# EAGLE schematic backpack_v1 (EAGLE 6.5.0)
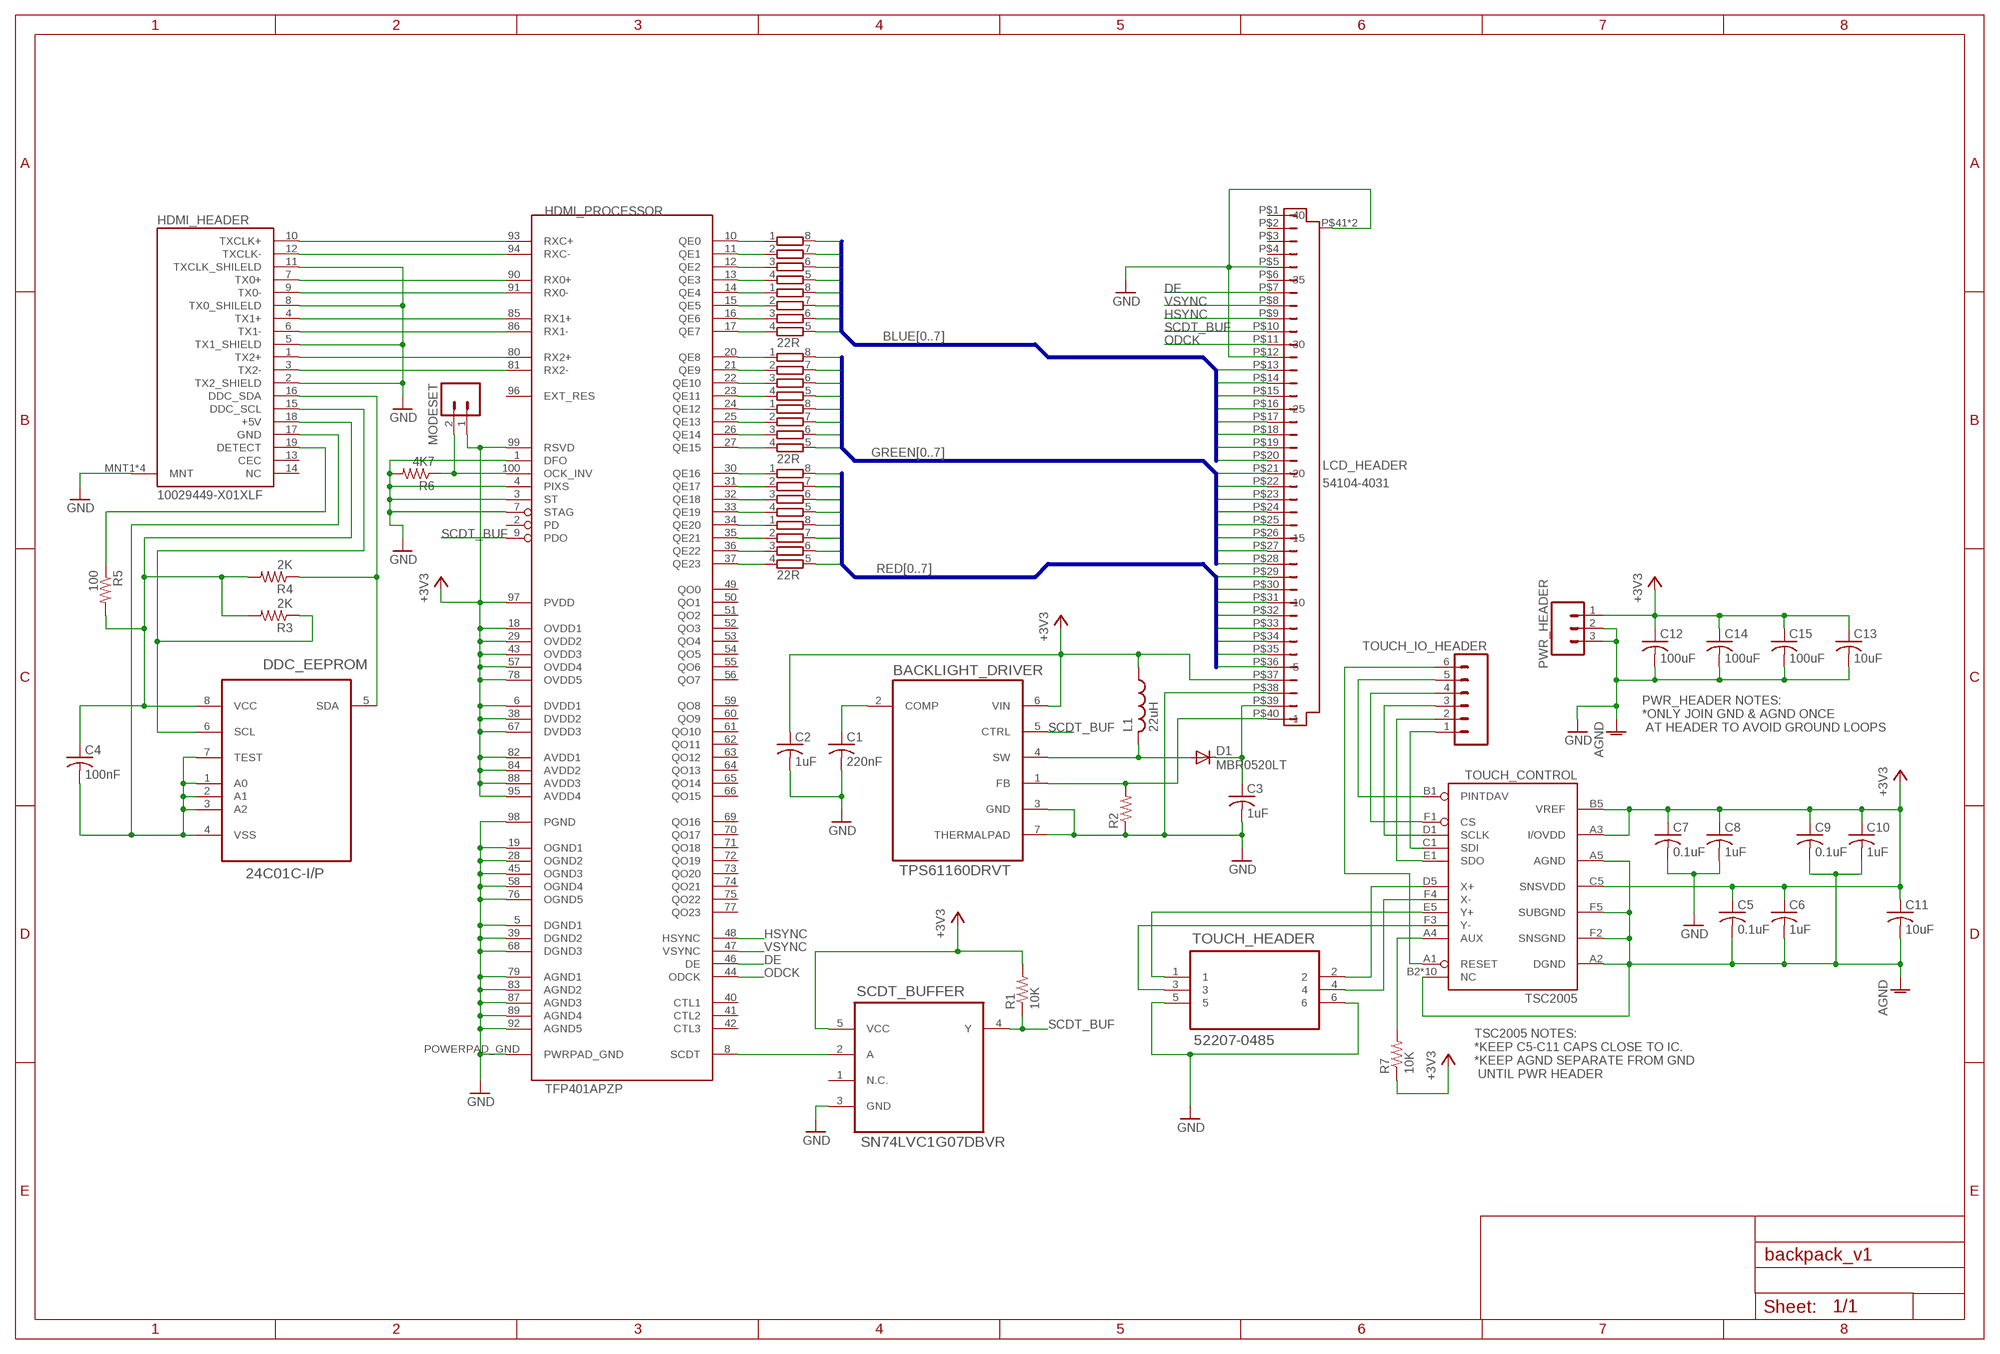
[diagram p0: schematic, sheet 1]

## Parts
BACKLIGHT_DRIVER  TPS61160DRVT  [SON65P210X210X80-7N]
C1  220nF  C-USC0805  [C0805]
C2  1uF  C-USC0805  [C0805]
C3  1uF  C-USC0805  [C0805]
C4  100nF  C-USC0805  [C0805]
C5  0.1uF  C-USC0805  [C0805]
C6  1uF  C-USC0805  [C0805]
C7  0.1uF  C-USC0805  [C0805]
C8  1uF  C-USC0805  [C0805]
C9  0.1uF  C-USC0805  [C0805]
C10  1uF  C-USC0805  [C0805]
C11  10uF  C-USC0805  [C0805]
C12  100uF  C-USC1206  [C1206]
C13  10uF  C-USC1206  [C1206]
C14  100uF  C-USC1206  [C1206]
C15  100uF  C-USC1206  [C1206]
D1  MBR0520LT  [SOD123]
DDC_EEPROM  24C01C-I/P  [DIP254P762X533-8]
HDMI_HEADER  10029449-X01XLF  [10029449]
HDMI_PROCESSOR  TFP401APZP  [100-TQFP(PZP)]
L1  22uH  L-USL4532P  [L4532P]
LCD_HEADER  54104-4031  [54104-4031]
MODESET  M02PTH  [1X02]
PWR_HEADER  M03POLAR  [MOLEX-1X3]
R1  10K  R-US_M1206  [M1206]
R2  R-US_M1206  [M1206]
R3  2K  R-US_M1206  [M1206]
R4  2K  R-US_M1206  [M1206]
R5  100  R-US_M1206  [M1206]
R6  4K7  R-US_M1206  [M1206]
R7  10K  R-US_M1206  [M1206]
RN1  22R  4R-NCAY16  [CAY16]
RN2  22R  4R-NCAY16  [CAY16]
RN3  22R  4R-NCAY16  [CAY16]
RN4  22R  4R-NCAY16  [CAY16]
RN5  22R  4R-NCAY16  [CAY16]
RN6  22R  4R-NCAY16  [CAY16]
SCDT_BUFFER  SN74LVC1G07DBVR  [SOT95P280X145-5N]
TOUCH_CONTROL  TSC2005  [YZL]
TOUCH_HEADER  52207-0485  [MOLEX_52207-0485]
TOUCH_IO_HEADER  M06RA  [MOLEX-1X6-RA]

## Nets
+3V3: BACKLIGHT_DRIVER.6(VIN) C2.1 C5.1 C6.1 C7.1 C8.1 C9.1 C10.1 C11.1 C12.1 C13.1 C14.1 C15.1 L1.1 LCD_HEADER.P$37 PWR_HEADER.1 R1.2 R7.1 SCDT_BUFFER.5(VCC) TOUCH_CONTROL.A3(I/OVDD) TOUCH_CONTROL.B5(VREF) TOUCH_CONTROL.C5(SNSVDD)
AGND: C5.2 C6.2 C9.2 C10.2 C11.2 TOUCH_CONTROL.A2(DGND) TOUCH_CONTROL.A5(AGND) TOUCH_CONTROL.B2(NC) TOUCH_CONTROL.B3(NC) TOUCH_CONTROL.B4(NC) TOUCH_CONTROL.C2(NC) TOUCH_CONTROL.D2(NC) TOUCH_CONTROL.D3(NC) TOUCH_CONTROL.D4(NC) TOUCH_CONTROL.E2(NC) TOUCH_CONTROL.E3(NC) TOUCH_CONTROL.E4(NC) TOUCH_CONTROL.F2(SNSGND) TOUCH_CONTROL.F5(SUBGND)
BLUE0: LCD_HEADER.P$20 RN1.8
BLUE1: LCD_HEADER.P$19 RN1.7
BLUE2: LCD_HEADER.P$18 RN1.6
BLUE3: LCD_HEADER.P$17 RN1.5
BLUE4: LCD_HEADER.P$16 RN2.8
BLUE5: LCD_HEADER.P$15 RN2.7
BLUE6: LCD_HEADER.P$14 RN2.6
BLUE7: LCD_HEADER.P$13 RN2.5
DE: HDMI_PROCESSOR.46(DE) LCD_HEADER.P$7
GND: BACKLIGHT_DRIVER.3(GND) BACKLIGHT_DRIVER.7(THERMALPAD) C1.2 C2.2 C3.2 C7.2 C8.2 C12.2 C13.2 C14.2 C15.2 HDMI_HEADER.2(TX2_SHIELD) HDMI_HEADER.5(TX1_SHIELD) HDMI_HEADER.8(TX0_SHILELD) HDMI_HEADER.11(TXCLK_SHILELD) HDMI_HEADER.MNT1(MNT) HDMI_HEADER.MNT2(MNT) HDMI_HEADER.MNT3(MNT) HDMI_HEADER.MNT4(MNT) HDMI_PROCESSOR.1(DFO) HDMI_PROCESSOR.3(ST) HDMI_PROCESSOR.4(PIXS) HDMI_PROCESSOR.5(DGND1) HDMI_PROCESSOR.7(STAG) HDMI_PROCESSOR.19(OGND1) HDMI_PROCESSOR.28(OGND2) HDMI_PROCESSOR.39(DGND2) HDMI_PROCESSOR.45(OGND3) HDMI_PROCESSOR.58(OGND4) HDMI_PROCESSOR.68(DGND3) HDMI_PROCESSOR.76(OGND5) HDMI_PROCESSOR.79(AGND1) HDMI_PROCESSOR.83(AGND2) HDMI_PROCESSOR.87(AGND3) HDMI_PROCESSOR.89(AGND4) HDMI_PROCESSOR.92(AGND5) HDMI_PROCESSOR.98(PGND) HDMI_PROCESSOR.POWERPAD_GND(PWRPAD_GND) LCD_HEADER.P$5 LCD_HEADER.P$12 LCD_HEADER.P$38 LCD_HEADER.P$41(GND) LCD_HEADER.P$42(GND) PWR_HEADER.2 PWR_HEADER.3 R2.1 R6.2 SCDT_BUFFER.3(GND) TOUCH_HEADER.5 TOUCH_HEADER.6 ; supply symbol labelled AGND
GREEN0: LCD_HEADER.P$28 RN3.8
GREEN1: LCD_HEADER.P$27 RN3.7
GREEN2: LCD_HEADER.P$26 RN3.6
GREEN3: LCD_HEADER.P$25 RN3.5
GREEN4: LCD_HEADER.P$24 RN4.8
GREEN5: LCD_HEADER.P$23 RN4.7
GREEN6: LCD_HEADER.P$22 RN4.6
GREEN7: LCD_HEADER.P$21 RN4.5
HSYNC: HDMI_PROCESSOR.48(HSYNC) LCD_HEADER.P$9
N$1: HDMI_PROCESSOR.10(QE0) RN1.1
N$2: HDMI_PROCESSOR.11(QE1) RN1.2
N$3: HDMI_PROCESSOR.12(QE2) RN1.3
N$4: HDMI_PROCESSOR.13(QE3) RN1.4
N$5: HDMI_PROCESSOR.14(QE4) RN2.1
N$6: HDMI_PROCESSOR.15(QE5) RN2.2
N$7: HDMI_PROCESSOR.16(QE6) RN2.3
N$8: HDMI_PROCESSOR.17(QE7) RN2.4
N$9: HDMI_PROCESSOR.20(QE8) RN3.1
N$10: HDMI_PROCESSOR.21(QE9) RN3.2
N$11: HDMI_PROCESSOR.22(QE10) RN3.3
N$12: HDMI_PROCESSOR.23(QE11) RN3.4
N$13: HDMI_PROCESSOR.24(QE12) RN4.1
N$14: HDMI_PROCESSOR.25(QE13) RN4.2
N$15: HDMI_PROCESSOR.26(QE14) RN4.3
N$16: HDMI_PROCESSOR.27(QE15) RN4.4
N$17: HDMI_PROCESSOR.30(QE16) RN5.1
N$18: HDMI_PROCESSOR.31(QE17) RN5.2
N$19: HDMI_PROCESSOR.32(QE18) RN5.3
N$20: HDMI_PROCESSOR.33(QE19) RN5.4
N$21: HDMI_PROCESSOR.34(QE20) RN6.1
N$22: HDMI_PROCESSOR.35(QE21) RN6.2
N$23: HDMI_PROCESSOR.36(QE22) RN6.3
N$24: HDMI_PROCESSOR.37(QE23) RN6.4
N$25: HDMI_PROCESSOR.8(SCDT) SCDT_BUFFER.2(A)
N$26: BACKLIGHT_DRIVER.2(COMP) C1.1
N$27: BACKLIGHT_DRIVER.4(SW) D1.A L1.2
N$28: C3.1 D1.C LCD_HEADER.P$39
N$29: HDMI_HEADER.10(TXCLK+) HDMI_PROCESSOR.93(RXC+)
N$30: BACKLIGHT_DRIVER.1(FB) LCD_HEADER.P$40 R2.2
N$31: HDMI_HEADER.12(TXCLK-) HDMI_PROCESSOR.94(RXC-)
N$32: HDMI_HEADER.7(TX0+) HDMI_PROCESSOR.90(RX0+)
N$33: HDMI_HEADER.9(TX0-) HDMI_PROCESSOR.91(RX0-)
N$34: HDMI_HEADER.4(TX1+) HDMI_PROCESSOR.85(RX1+)
N$35: HDMI_HEADER.6(TX1-) HDMI_PROCESSOR.86(RX1-)
N$36: HDMI_HEADER.1(TX2+) HDMI_PROCESSOR.80(RX2+)
N$37: HDMI_HEADER.3(TX2-) HDMI_PROCESSOR.81(RX2-)
N$38: HDMI_PROCESSOR.100(OCK_INV) MODESET.2 R6.1
N$39: DDC_EEPROM.5(SDA) HDMI_HEADER.16(DDC_SDA) R4.1
N$40: DDC_EEPROM.6(SCL) HDMI_HEADER.15(DDC_SCL) R3.1
N$41: TOUCH_CONTROL.E5(Y+) TOUCH_HEADER.1
N$42: TOUCH_CONTROL.F3(Y-) TOUCH_HEADER.3
N$43: C4.1 DDC_EEPROM.8(VCC) HDMI_HEADER.18(+5V) R3.2 R4.2 R5.2
N$44: TOUCH_CONTROL.D5(X+) TOUCH_HEADER.2
N$45: C4.2 DDC_EEPROM.1(A0) DDC_EEPROM.2(A1) DDC_EEPROM.3(A2) DDC_EEPROM.4(VSS) DDC_EEPROM.7(TEST) HDMI_HEADER.17(GND)
N$46: HDMI_HEADER.19(DETECT) R5.1
N$47: R7.2 TOUCH_CONTROL.A4(AUX)
N$48: TOUCH_CONTROL.A1(RESET) TOUCH_IO_HEADER.6
N$49: TOUCH_CONTROL.F4(X-) TOUCH_HEADER.4
N$50: TOUCH_CONTROL.C1(SDI) TOUCH_IO_HEADER.1
N$51: TOUCH_CONTROL.E1(SDO) TOUCH_IO_HEADER.2
N$52: TOUCH_CONTROL.D1(SCLK) TOUCH_IO_HEADER.3
N$53: TOUCH_CONTROL.F1(CS) TOUCH_IO_HEADER.4
N$54: TOUCH_CONTROL.B1(PINTDAV) TOUCH_IO_HEADER.5
ODCK: HDMI_PROCESSOR.44(ODCK) LCD_HEADER.P$11
RED0: LCD_HEADER.P$36 RN5.8
RED1: LCD_HEADER.P$35 RN5.7
RED2: LCD_HEADER.P$34 RN5.6
RED3: LCD_HEADER.P$33 RN5.5
RED4: LCD_HEADER.P$32 RN6.8
RED5: LCD_HEADER.P$31 RN6.7
RED6: LCD_HEADER.P$30 RN6.6
RED7: LCD_HEADER.P$29 RN6.5
SCDT_BUF: BACKLIGHT_DRIVER.5(CTRL) HDMI_PROCESSOR.9(PDO) LCD_HEADER.P$10 R1.1 SCDT_BUFFER.4(Y)
VDD: HDMI_PROCESSOR.6(DVDD1) HDMI_PROCESSOR.18(OVDD1) HDMI_PROCESSOR.29(OVDD2) HDMI_PROCESSOR.38(DVDD2) HDMI_PROCESSOR.43(OVDD3) HDMI_PROCESSOR.57(OVDD4) HDMI_PROCESSOR.67(DVDD3) HDMI_PROCESSOR.78(OVDD5) HDMI_PROCESSOR.82(AVDD1) HDMI_PROCESSOR.84(AVDD2) HDMI_PROCESSOR.88(AVDD3) HDMI_PROCESSOR.95(AVDD4) HDMI_PROCESSOR.97(PVDD) HDMI_PROCESSOR.99(RSVD) MODESET.1 ; supply symbol labelled +3V3
VSYNC: HDMI_PROCESSOR.47(VSYNC) LCD_HEADER.P$8
Unconnected: HDMI_HEADER.13(CEC) HDMI_HEADER.14(NC) HDMI_PROCESSOR.2(PD) HDMI_PROCESSOR.40(CTL1) HDMI_PROCESSOR.41(CTL2) HDMI_PROCESSOR.42(CTL3) HDMI_PROCESSOR.49(QO0) HDMI_PROCESSOR.50(QO1) HDMI_PROCESSOR.51(QO2) HDMI_PROCESSOR.52(QO3) HDMI_PROCESSOR.53(QO4) HDMI_PROCESSOR.54(QO5) HDMI_PROCESSOR.55(QO6) HDMI_PROCESSOR.56(QO7) HDMI_PROCESSOR.59(QO8) HDMI_PROCESSOR.60(QO9) HDMI_PROCESSOR.61(QO10) HDMI_PROCESSOR.62(QO11) HDMI_PROCESSOR.63(QO12) HDMI_PROCESSOR.64(QO13) HDMI_PROCESSOR.65(QO14) HDMI_PROCESSOR.66(QO15) HDMI_PROCESSOR.69(QO16) HDMI_PROCESSOR.70(QO17) HDMI_PROCESSOR.71(QO18) HDMI_PROCESSOR.72(QO19) HDMI_PROCESSOR.73(QO20) HDMI_PROCESSOR.74(QO21) HDMI_PROCESSOR.75(QO22) HDMI_PROCESSOR.77(QO23) HDMI_PROCESSOR.96(EXT_RES) LCD_HEADER.P$1 LCD_HEADER.P$2 LCD_HEADER.P$3 LCD_HEADER.P$4 LCD_HEADER.P$6 SCDT_BUFFER.1(N.C.)

## Buses
BLUE[0..7]
GREEN[0..7]
RED[0..7]

## Notes on the sheet
- PWR_HEADER NOTES:
  *ONLY JOIN GND & AGND ONCE 
   AT HEADER TO AVOID GROUND LOOPS
- TSC2005 NOTES:
  *KEEP C5-C11 CAPS CLOSE TO IC.
  *KEEP AGND SEPARATE FROM GND
   UNTIL PWR HEADER

## Library data of the parts
BACKLIGHT_DRIVER = newark-TI-TPS61160:TPS61160DRVT: White LED Driver With Digital and PWM Brightness Control in 2mm x 2mm QFN Package for up to 10 LEDs in Series; MPN: TPS61160DRVT; OC_FARNELL: 1603420; OC_NEWARK: 65M6336; PACKAGE: SON-6; SUPPLIER: Texas Instruments
C1-C15 = resistor:C-US: CAPACITOR, American symbol
D1 = diode:MBR0520LT: SCHOTTKY BARRIER RECTIFIER Source: http://onsemi.com .. MBR0520LT1-D.pdf
DDC_EEPROM = newark-Microchip-24C01CIP:24C01C-I/P: IC EEPROM 1KBIT 400KHZ,DIP-8; MPN: 24C01C-I/P; OC_FARNELL: 1847800; OC_NEWARK: 92C6948; PACKAGE: DIP-8; SUPPLIER: Microchip
HDMI_HEADER = ccbtech-FCI:10029449-X01XLF
HDMI_PROCESSOR = ccbtech-TI:TFP401A
L1 = resistor:L-US: INDUCTOR, American symbol
LCD_HEADER = ccbtech-Molex:54104-4031
MODESET = SparkFun-Connectors:M02: Header 2 Standard 2-pin 0.1" header. Use with straight break away headers (SKU : PRT-00116), right angle break away headers (PRT-00553), swiss pins (PRT-00743), machine pins (PRT-00117), and female headers (PRT-00115). Molex polarized connector foot print use with SKU : PRT-08233 with associated crimp pins and housings.
PWR_HEADER = SparkFun-Connectors:M03: Header 3 Standard 3-pin 0.1" header. Use with straight break away headers (SKU : PRT-00116), right angle break away headers (PRT-00553), swiss pins (PRT-00743), machine pins (PRT-00117), and female headers (PRT-00115). Molex polarized connector foot print use with SKU : PRT-08232 with associated crimp pins and housings.
R1-R7 = resistor:R-US_: RESISTOR, American symbol
RN1-RN6 = resistor-dil:4R-N: Array Chip Resistor Source: RS Component / Phycomp; OC_FARNELL: unknown; OC_NEWARK: unknown
SCDT_BUFFER = newark-TI-SN74LVC1G07:SN74LVC1G07DBVR: SINGLE BUFFER/DRIVER WITH OPEN-DRAIN OUTPUT; MPN: SN74LVC1G07DBVR; OC_FARNELL: 1102969; OC_NEWARK: 39C2931; PACKAGE: SOT-23-5; SUPPLIER: Texas Instruments
TOUCH_CONTROL = ccbtech-TI:TSC2005
TOUCH_HEADER = Molex_By_element14_Batch_1:52207-0485: SOCKET FPC, SMT, 1MM, 4 WAY; MPN: 52207-0485; OC_FARNELL: 1463013; OC_NEWARK: 58J9499; PACKAGE: SOCKET FPC, SMT, 1MM, 4 WAY; SUPPLIER: Molex
TOUCH_IO_HEADER = SparkFun-Connectors:M06: Header 6 Standard 6-pin 0.1" header. Use with straight break away headers (SKU : PRT-00116), right angle break away headers (PRT-00553), swiss pins (PRT-00743), machine pins (PRT-00117), and female headers (PRT-00115). Molex polarized connector foot print use with SKU : PRT-08094 with associated crimp pins and housings. NOTES ON THE VARIANTS LOCK and LOCK_LONGPADS... This footprint was designed to help hold the alignment of a through-hole component (i.e. 6-pin header) while soldering it into place. You may notice that each hole has been shifted either up or down by 0.005 of an inch from it's more standard position (which is a perfectly straight line). This slight alteration caused the pins (the squares in the middle) to touch the edges of the holes. Because they are alternating, it causes a "brace" to hold the component in place. 0.005 has proven to be the perfect amount of "off-center" position when using our standard breakaway headers. Although looks a little odd when you look at the bare footprint, once you have a header in there, the alteration is very hard to notice. Also, if you push a header all the way into place, it is covered up entirely on the bottom side. This idea of altering the position of holes to aid alignment will be further integrated into the Sparkfun Library for other footprints. It can help hold any component with 3 or more connection pins.